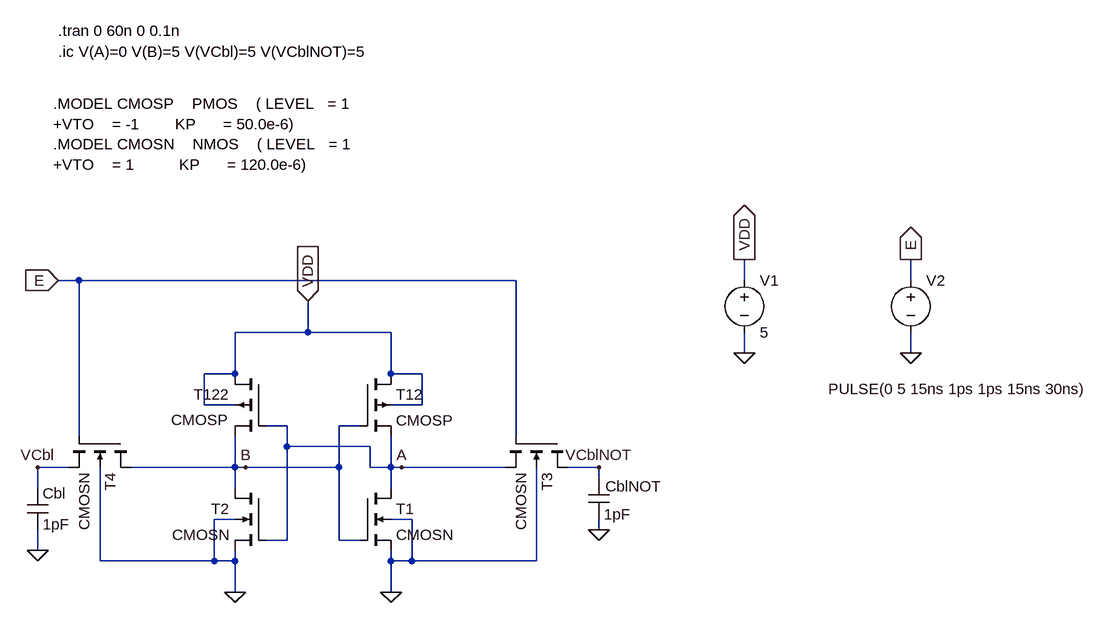
[diagram p0: schematic ParcialEj3.asc]
ParcialEj3.asc, the LTspice schematic file:
Version 4
SHEET 1 2188 2820
WIRE -1584 -480 -1616 -480
WIRE -912 -480 -1584 -480
WIRE -560 -480 -560 -512
WIRE -304 -480 -304 -512
WIRE -1232 -400 -1232 -448
WIRE -1232 -400 -1344 -400
WIRE -1104 -400 -1232 -400
WIRE -560 -368 -560 -400
WIRE -304 -368 -304 -400
WIRE -1344 -336 -1344 -400
WIRE -1344 -336 -1392 -336
WIRE -1104 -336 -1104 -400
WIRE -1056 -336 -1104 -336
WIRE -1392 -288 -1392 -336
WIRE -1344 -288 -1392 -288
WIRE -1056 -288 -1056 -336
WIRE -1056 -288 -1104 -288
WIRE -1264 -256 -1296 -256
WIRE -1152 -256 -1184 -256
WIRE -1584 -240 -1584 -480
WIRE -912 -240 -912 -480
WIRE -1264 -224 -1264 -256
WIRE -1136 -224 -1264 -224
WIRE -1600 -192 -1648 -192
WIRE -1344 -192 -1344 -240
WIRE -1344 -192 -1504 -192
WIRE -1328 -192 -1344 -192
WIRE -1184 -192 -1184 -256
WIRE -1184 -192 -1328 -192
WIRE -1136 -192 -1136 -224
WIRE -1104 -192 -1104 -240
WIRE -1104 -192 -1136 -192
WIRE -1088 -192 -1104 -192
WIRE -928 -192 -1088 -192
WIRE -784 -192 -832 -192
WIRE -784 -176 -784 -192
WIRE -1648 -160 -1648 -192
WIRE -1344 -160 -1344 -192
WIRE -1104 -160 -1104 -192
WIRE -1344 -112 -1376 -112
WIRE -1072 -112 -1104 -112
WIRE -784 -96 -784 -112
WIRE -1264 -80 -1264 -224
WIRE -1264 -80 -1296 -80
WIRE -1184 -80 -1184 -192
WIRE -1152 -80 -1184 -80
WIRE -1648 -64 -1648 -96
WIRE -1552 -48 -1552 -192
WIRE -1376 -48 -1376 -112
WIRE -1376 -48 -1552 -48
WIRE -1344 -48 -1344 -64
WIRE -1344 -48 -1376 -48
WIRE -1104 -48 -1104 -64
WIRE -1072 -48 -1072 -112
WIRE -1072 -48 -1104 -48
WIRE -880 -48 -880 -192
WIRE -880 -48 -1072 -48
WIRE -1344 0 -1344 -48
WIRE -1104 0 -1104 -48
FLAG -560 -368 0
FLAG -560 -512 VDD
IOPIN -560 -512 Out
FLAG -1232 -448 VDD
IOPIN -1232 -448 In
FLAG -304 -368 0
FLAG -304 -512 E
IOPIN -304 -512 Out
FLAG -1344 0 0
FLAG -1104 0 0
FLAG -1616 -480 E
IOPIN -1616 -480 In
FLAG -1088 -192 A
FLAG -1328 -192 B
FLAG -1648 -64 0
FLAG -784 -96 0
FLAG -1648 -192 VCbl
FLAG -784 -192 VCblNOT
SYMBOL voltage -560 -496 R0
WINDOW 123 0 0 Left 0
WINDOW 39 0 0 Left 0
SYMATTR InstName V1
SYMATTR Value 5
SYMBOL voltage -304 -496 R0
WINDOW 123 0 0 Left 0
WINDOW 39 0 0 Left 0
WINDOW 3 -127 183 Left 2
SYMATTR Value PULSE(0 5 15ns 1ps 1ps 15ns 30ns)
SYMATTR InstName V2
SYMBOL nmos4 -1504 -240 R90
SYMATTR InstName T4
SYMATTR Value CMOSN
SYMATTR Value2 l=1u w=1.16u
SYMBOL nmos4 -832 -240 R90
SYMATTR InstName T3
SYMATTR Value CMOSN
SYMATTR Value2 l=1u w=1.16u
SYMBOL pmos4 -1152 -336 R0
SYMATTR InstName T12
SYMATTR Value CMOSP
SYMATTR Value2 l=1u w=9u
SYMBOL pmos4 -1296 -336 M0
WINDOW 3 59 71 Left 2
SYMATTR Value CMOSP
SYMATTR InstName T122
SYMATTR Value2 l=1u w=9u
SYMBOL nmos4 -1296 -160 M0
SYMATTR InstName T2
SYMATTR Value CMOSN
SYMATTR Value2 l=1u w=3u
SYMBOL nmos4 -1152 -160 R0
SYMATTR InstName T1
SYMATTR Value CMOSN
SYMATTR Value2 l=1u w=3u
SYMBOL cap -1664 -160 R0
SYMATTR InstName Cbl
SYMATTR Value 1pF
SYMBOL cap -800 -176 R0
WINDOW 0 26 13 Left 2
SYMATTR InstName CblNOT
SYMATTR Value 1pF
TEXT -1616 -864 Left 2 !.tran 0 60n 0 0.1n
TEXT -1616 -832 Left 2 !.ic V(A)=0 V(B)=5 V(VCbl)=5 V(VCblNOT)=5
TEXT -1624 -752 Left 2 !.MODEL CMOSP    PMOS    ( LEVEL   = 1\n+VTO    = -1        KP      = 50.0e-6)\n.MODEL CMOSN    NMOS    ( LEVEL   = 1\n+VTO    = 1          KP      = 120.0e-6)

The netlist it stands for:
* ParcialEj3.asc
V1 VDD 0 5
V2 E 0 PULSE(0 5 15ns 1ps 1ps 15ns 30ns)
M§T4 B E VCbl 0 CMOSN l=1u w=1.16u
M§T3 VCblNOT E A 0 CMOSN l=1u w=1.16u
M§T12 VDD B A VDD CMOSP l=1u w=9u
M§T122 VDD A B VDD CMOSP l=1u w=9u
M§T2 B A 0 0 CMOSN l=1u w=3u
M§T1 A B 0 0 CMOSN l=1u w=3u
Cbl VCbl 0 1pF
CblNOT VCblNOT 0 1pF
.model NMOS NMOS
.model PMOS PMOS
.lib standard.mos
.tran 0 60n 0 0.1n
.ic V(A)=0 V(B)=5 V(VCbl)=5 V(VCblNOT)=5
.MODEL CMOSP    PMOS    ( LEVEL   = 1
+VTO    = -1        KP      = 50.0e-6)
.MODEL CMOSN    NMOS    ( LEVEL   = 1
+VTO    = 1          KP      = 120.0e-6)
.backanno
.end

* Results of the author's LTspice run, read from the files saved beside the schematic
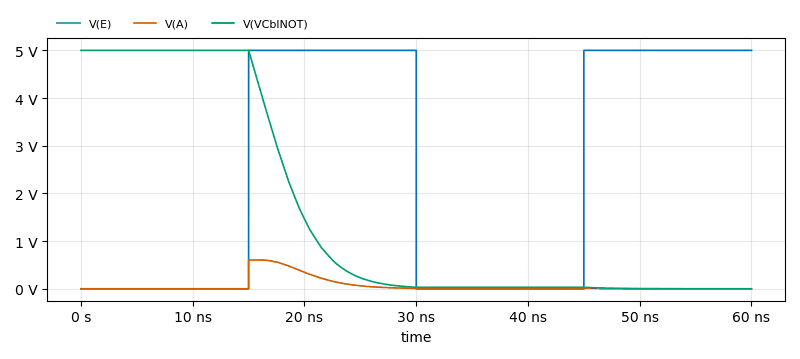
[diagram p1: Transient Analysis of ParcialEj3.asc, plotted from the saved traces]
* Transient Analysis, 1 run:
*   V(E): min 0 V, max 5 V, average 2.5 V, rms 3.536 V, last 5 V
*   V(A): min -383.8 nV, max 603.4 mV, average 61.2 mV, rms 164.4 mV, last 21.56 µV
*   V(VCblNOT): min 77.3 µV, max 5 V, average 1.582 V, rms 2.682 V, last 77.3 µV